# Altium schematic sheet Converter.SchDoc: Buck Sinc Converter
size A4; Organization: UDESC; Revision: R0; SheetNumber: 2; SheetTotal: 10
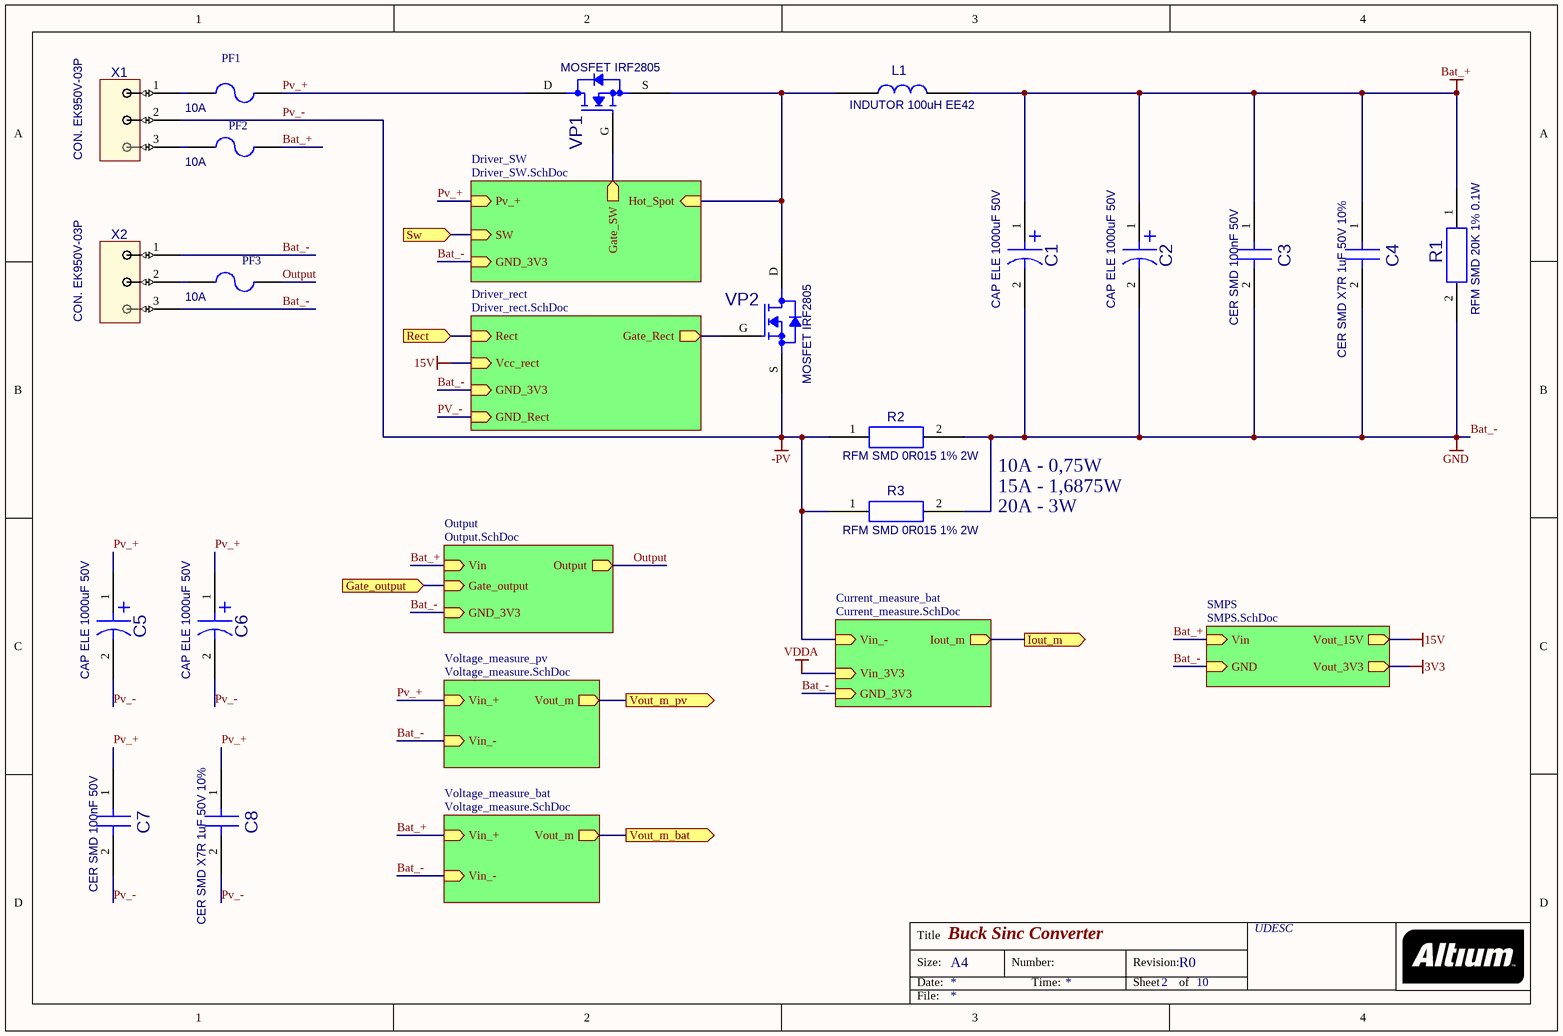
[diagram p0: Converter.SchDoc]

## Parts
C1  value CAP ELE 1000uF 50V  [CR 1.1 7.62 16.5]  (hidden comment: 10190340)
C2  value CAP ELE 1000uF 50V  [CR 1.1 7.62 16.5]  (hidden comment: 10190340)
C3  value CER SMD 100nF 50V  [C0805_R_V0]  (hidden comment: 10192075)
C4  value CER SMD X7R 1uF 50V 10%  [C0805_R_V0]  (hidden comment: 11736520)
C5  value CAP ELE 1000uF 50V  [CR 1.1 7.62 16.5]  (hidden comment: 10190340)
C6  value CAP ELE 1000uF 50V  [CR 1.1 7.62 16.5]  (hidden comment: 10190340)
C7  value CER SMD 100nF 50V  [C0805_R_V0]  (hidden comment: 10192075)
C8  value CER SMD X7R 1uF 50V 10%  [C0805_R_V0]  (hidden comment: 11736520)
L1  INDUTOR 100uH EE42  [INDUTOR EE42_V1]
PF1  10A  [Fuse_holder]
PF2  10A  [Fuse_holder]
PF3  10A  [Fuse_holder]
R1  value RFM SMD 20K 1% 0.1W  [R0805A]  (hidden comment: 10191996)
R2  value RFM SMD 0R015 1% 2W  [WSL2816A]  (hidden comment: 11372881)
R3  value RFM SMD 0R015 1% 2W  [WSL2816A]  (hidden comment: 11372881)
VP1  value MOSFET IRF2805  [TO-220AB_V1]  (hidden comment: 10190449)
VP2  value MOSFET IRF2805  [TO-220AB_V1]  (hidden comment: 10190449)
X1  value CON. EK950V-03P  [662-A-111/03-SM]  (hidden comment: 10233722)
X2  value CON. EK950V-03P  [662-A-111/03-SM]  (hidden comment: 10233722)

## Sub-sheets
Current_measure_bat = Current_measure.SchDoc: Vin_- (in), Iout_m (out), Vin_3V3 (in), GND_3V3 (in)
Driver_rect = Driver_rect.SchDoc: Rect (in), Gate_Rect (out), GND_3V3 (in), Vcc_rect (in), GND_Rect (in)
Driver_SW = Driver_SW.SchDoc: Pv_+ (in), Gate_SW (out), GND_3V3 (in), SW (in), Hot_Spot (in)
Output = Output.SchDoc: Gate_output (in), GND_3V3 (in), Output (out), Vin (in)
SMPS = SMPS.SchDoc: Vin (in), GND (in), Vout_3V3 (out), Vout_15V (out)
Voltage_measure_bat = Voltage_measure.SchDoc: Vin_+ (in), Vin_- (in), Vout_m (out)
Voltage_measure_pv = Voltage_measure.SchDoc: Vin_+ (in), Vin_- (in), Vout_m (out)

## Ports
Gate_output (in), Iout_m (out), Rect (in), Sw (in), Vout_m_bat (out), Vout_m_pv (out)

## Nets
3V3: sheet SMPS/Vout_3V3
15V: sheet Driver_rect/Vcc_rect, sheet SMPS/Vout_15V
Bat_+: C1.1 C2.1 C3.1 C4.1 L1.2 PF2.2 R1.1 ; sheet Voltage_measure_bat/Vin_+, sheet SMPS/Vin, sheet Output/Vin
Bat_-: C1.2 C2.2 C3.2 C4.2 R1.2 R2.2 R3.2 X2.1 X2.3 ; sheet Voltage_measure_pv/Vin_-, sheet Voltage_measure_bat/Vin_-, sheet Driver_rect/GND_3V3, sheet Current_measure_bat/GND_3V3, sheet SMPS/GND, sheet Driver_SW/GND_3V3, sheet Output/GND_3V3  [also labelled GND]
Pv_-: C5.2 C6.2 C7.2 C8.2 R2.1 R3.1 VP2.S X1.2 ; sheet Driver_rect/GND_Rect, sheet Current_measure_bat/Vin_-  [also labelled -PV]
VDDA: sheet Current_measure_bat/Vin_3V3
Gate_output: port Gate_output, sheet Output/Gate_output
Iout_m: port Iout_m, sheet Current_measure_bat/Iout_m
Output: PF3.2 ; sheet Output/Output
Pv_+: C5.1 C6.1 C7.1 C8.1 PF1.2 VP1.D ; sheet Voltage_measure_pv/Vin_+, sheet Driver_SW/Pv_+
Rect: port Rect, sheet Driver_rect/Rect
Sw: port Sw, sheet Driver_SW/SW
Vout_m_bat: port Vout_m_bat, sheet Voltage_measure_bat/Vout_m
Vout_m_pv: port Vout_m_pv, sheet Voltage_measure_pv/Vout_m
NetL1_1: L1.1 VP1.S VP2.D ; sheet Driver_SW/Hot_Spot
NetPF1_1: PF1.1 X1.1
NetPF2_1: PF2.1 X1.3
NetPF3_1: PF3.1 X2.2
NetVP1_G: VP1.G ; sheet Driver_SW/Gate_SW
NetVP2_G: VP2.G ; sheet Driver_rect/Gate_Rect

## Notes on the sheet
- 10A - 0,75W
- 15A - 1,6875W
- 20A - 3W
- Title
- Size:
- Date:
- A4
- Number:
- Time:
- Revision:
- Sheet
- of
- File:

## Library data of the parts
C1 C2 C5 C6 = 10190340: CAP ELE 1000uF 50V; HISsym: Atualizado em 19/10/05; TOL: 20%; PMT: THT; PN: 10190340
C3 C7 = 10192075: CER SMD 100nF 50V; HISsym: Atualizado em 12/07/05; TOL: 10%; ITEM BAAN: 0333.0044; PN: 10192075; PMT: SMD
C4 C8 = 11736520: CER SMD X7R 1uF 50V 10%; HISsym: Atualizado em 12/07/05; HISitem: Criado em 15/04/11 (p/ Sandro W.); PN: 11736520; PMT: SMD
L1 = 12578205: INDUTOR 560uH 4A PCV-2; HISitem: Criado em 18/04/13 (p/ Adriano); Altura: 28mm; PMT: THT; PN: 12578205; ComponenteLink1URL: http://www.coilcraft.com/pdfs/pcv.pdf; Value: INDUTOR 100uH EE42
PF1 = Fuse 2: PN: FUSE; PMT: THT; Published: 8-Jun-2000; LatestRevisionDate: 17-Jul-2002; LatestRevisionNote: Re-released for DXP Platform.; PackageReference: PIN-W2/E2.8; Publisher: Altium Limited; Value: 10A
PF2 PF3 = Fuse 2: Fuse; PMT: THT; Published: 8-Jun-2000; LatestRevisionDate: 17-Jul-2002; LatestRevisionNote: Re-released for DXP Platform.; PackageReference: PIN-W2/E2.8; Publisher: Altium Limited; PN: 10A; Value: 10A
R1 = 10191996: RFM SMD 20K 1% 0.1W; HISsym: Atualizado em 20/07/05; PN: 10191996; PMT: SMD
R2 R3 = 11372881: RFM SMD 0R015 1% 2W; HISsym: Atualizado em 20/07/05; HISitem: Criado em 19/01/10 (p/ Emilio); PN: 11372881; PMT: SMD; ComponentLink1URL: *
VP1 VP2 = 10190449: MOSFET IRFB31N20D; HISsym: Atualizado em 20/04/06; HISitem: Criado em 20/04/06; PMT: THT; PN: 10190449
X1 X2 = 10233722: CON. EK950V-03P; HISitem: Atualizado Pattern em 01/09/06; Altura: 21,6mm; PMT: THT; PN: 10233722; ComponentLink1URL: *